# EAGLE design T1200 (EAGLE 9.5.0)
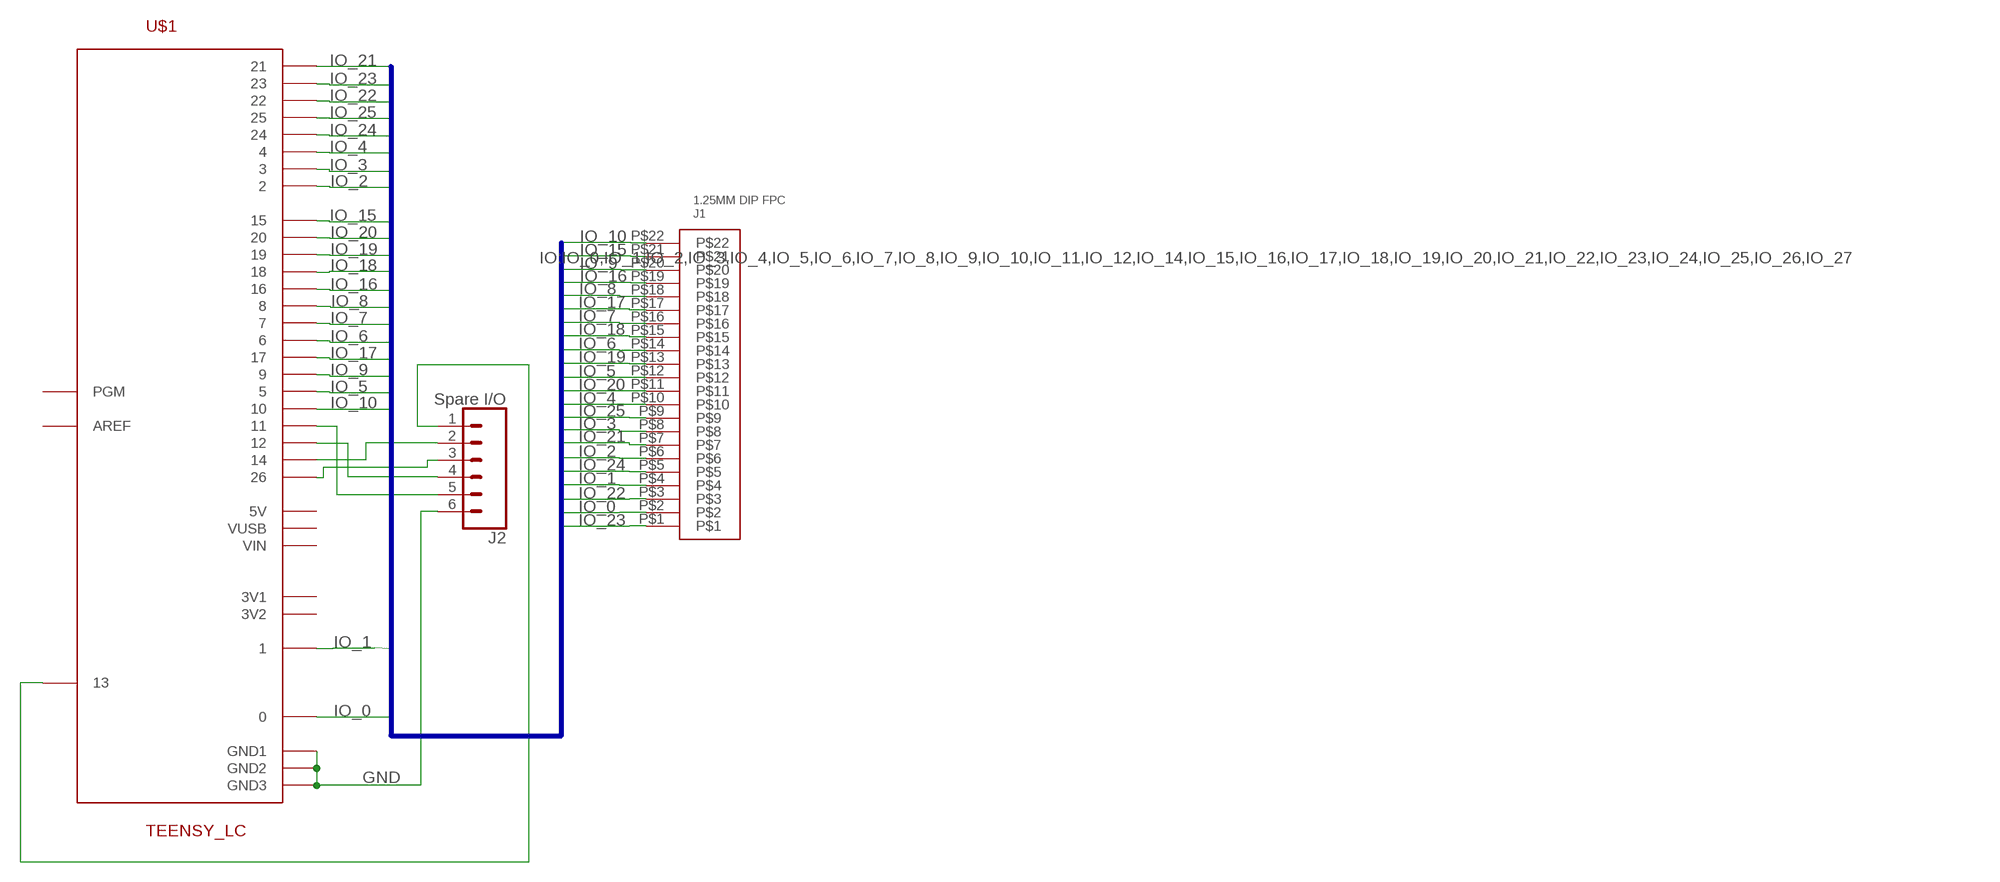
[diagram p0: schematic, sheet 1]

## Parts
J1  1.25MM DIP FPC  T1200_CON  [T1200_CON]
J2  Spare I/O  CONN_06SILK_FEMALE_PTH  [1X06]
U$1  TEENSY_LC  [TEENSY_LC]

## Nets
GND: J2.6 U$1.GND1 U$1.GND2 U$1.GND3
IO_0: J1.P$2 U$1.0
IO_1: J1.P$4 U$1.1
IO_2: J1.P$6 U$1.2
IO_3: J1.P$8 U$1.3
IO_4: J1.P$10 U$1.4
IO_5: J1.P$12 U$1.5
IO_6: J1.P$14 U$1.6
IO_7: J1.P$16 U$1.7
IO_8: J1.P$18 U$1.8
IO_9: J1.P$20 U$1.9
IO_10: J1.P$22 U$1.10
IO_15: J1.P$21 U$1.15
IO_16: J1.P$19 U$1.16
IO_17: J1.P$17 U$1.17
IO_18: J1.P$15 U$1.18
IO_19: J1.P$13 U$1.19
IO_20: J1.P$11 U$1.20
IO_21: J1.P$7 U$1.21
IO_22: J1.P$3 U$1.22
IO_23: J1.P$1 U$1.23
IO_24: J1.P$5 U$1.24
IO_25: J1.P$9 U$1.25
N$1: J2.1 U$1.13
N$2: J2.4 U$1.12
N$4: J2.3 U$1.26
N$5: J2.2 U$1.14
N$7: J2.5 U$1.11
Unconnected: U$1.3V1 U$1.3V2 U$1.5V U$1.AREF U$1.PGM U$1.VIN U$1.VUSB

## Buses
IO:IO_0,IO_1,IO_2,IO_3,IO_4,IO_5,IO_6,IO_7,IO_8,IO_9,IO_10,IO_11,IO_12,IO_14,IO_15,IO_16,IO_17,IO_18,IO_19,IO_20,IO_21,IO_22,IO_23,IO_24,IO_25,IO_26,IO_27

## Library data of the parts
J1 = T1200:T1200_CON
J2 = SparkFun-Connectors:CONN_06: Multi connection point. Often used as Generic Header-pin footprint for 0.1 inch spaced/style header connections On any of the 0.1 inch spaced packages, you can populate with these: Break Away Headers - Straight <https://www.sparkfun.com/products/116> (PRT-00116) Break Away Male Headers - Right Angle <https://www.sparkfun.com/products/553> (PRT-00553) Female Headers <https://www.sparkfun.com/products/115> (PRT-00115) Break Away Headers - Machine Pin <https://www.sparkfun.com/products/117> (PRT-00117) Break Away Female Headers - Swiss Machine Pin <https://www.sparkfun.com/products/743> (PRT-00743) Arduino Stackable Header - 6 Pin <https://www.sparkfun.com/products/9280> (PRT-09280) For SCREWTERMINALS and SPRING TERMINALS visit here: Screw Terimnals on SparkFun.com <https://www.sparkfun.com/search/results?term=Screw+Terminals> (5mm/3.5mm/2.54mm spacing) This device is also useful as a general connection point to wire up your design to another part of your project. Our various solder wires solder well into these plated through hole pads. Hook-Up Wire - Assortment (Stranded, 22 AWG) <https://www.sparkfun.com/products/11375> (PRT-11375) Hook-Up Wire - Assortment (Solid Core, 22 AWG) <https://www.sparkfun.com/products/11367> (PRT-11367) View the entire wire category on our website here <https://www.sparkfun.com/categories/141>; PROD_ID: CONN-08437
U$1 = Teensy_LC:TEENSY_LC

## Board
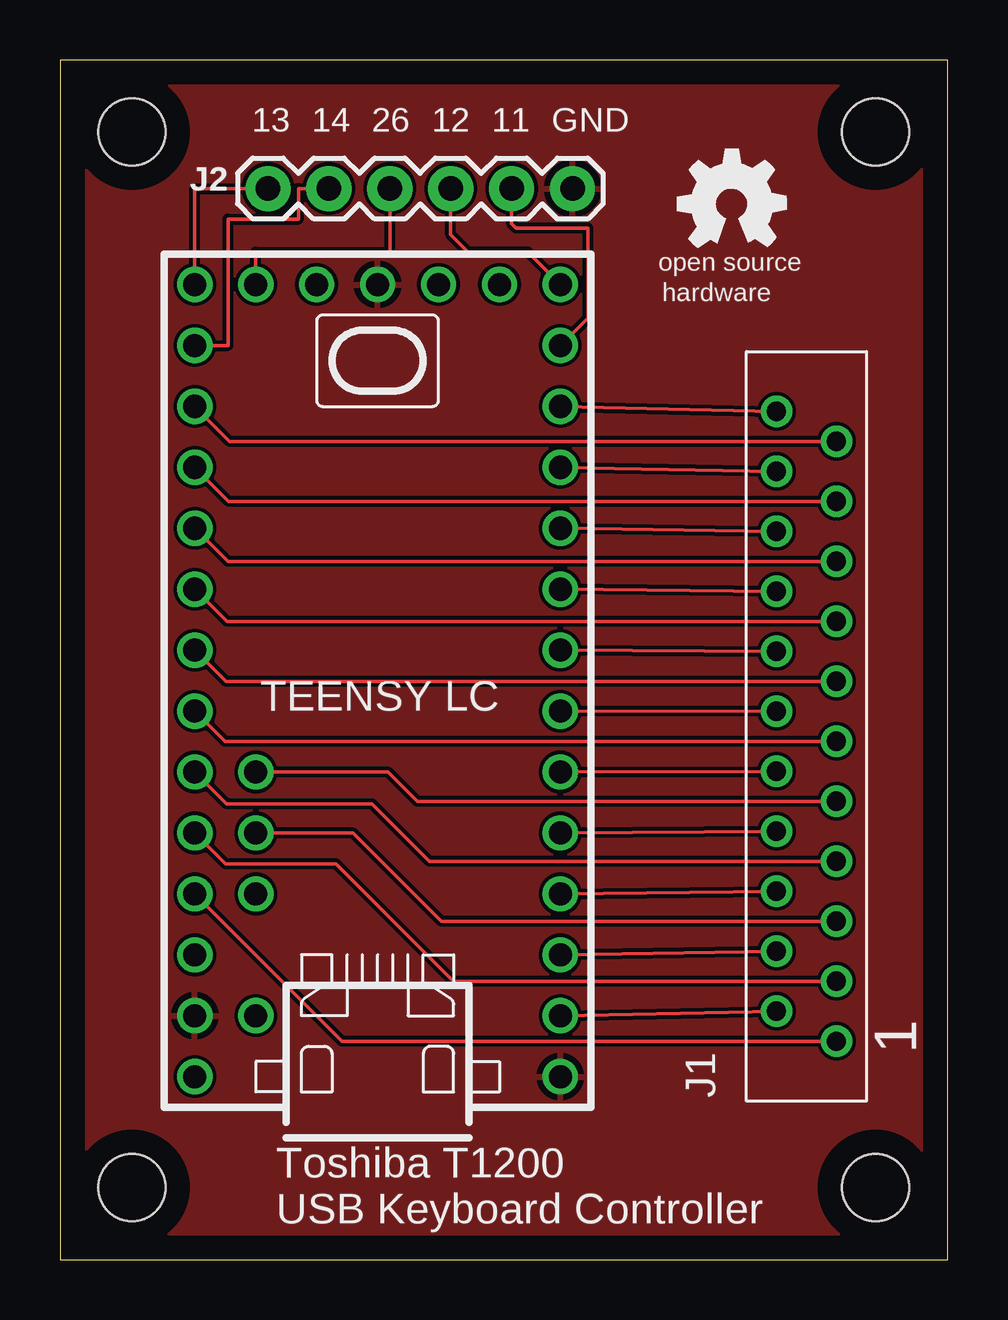
[diagram p1: board, top side]
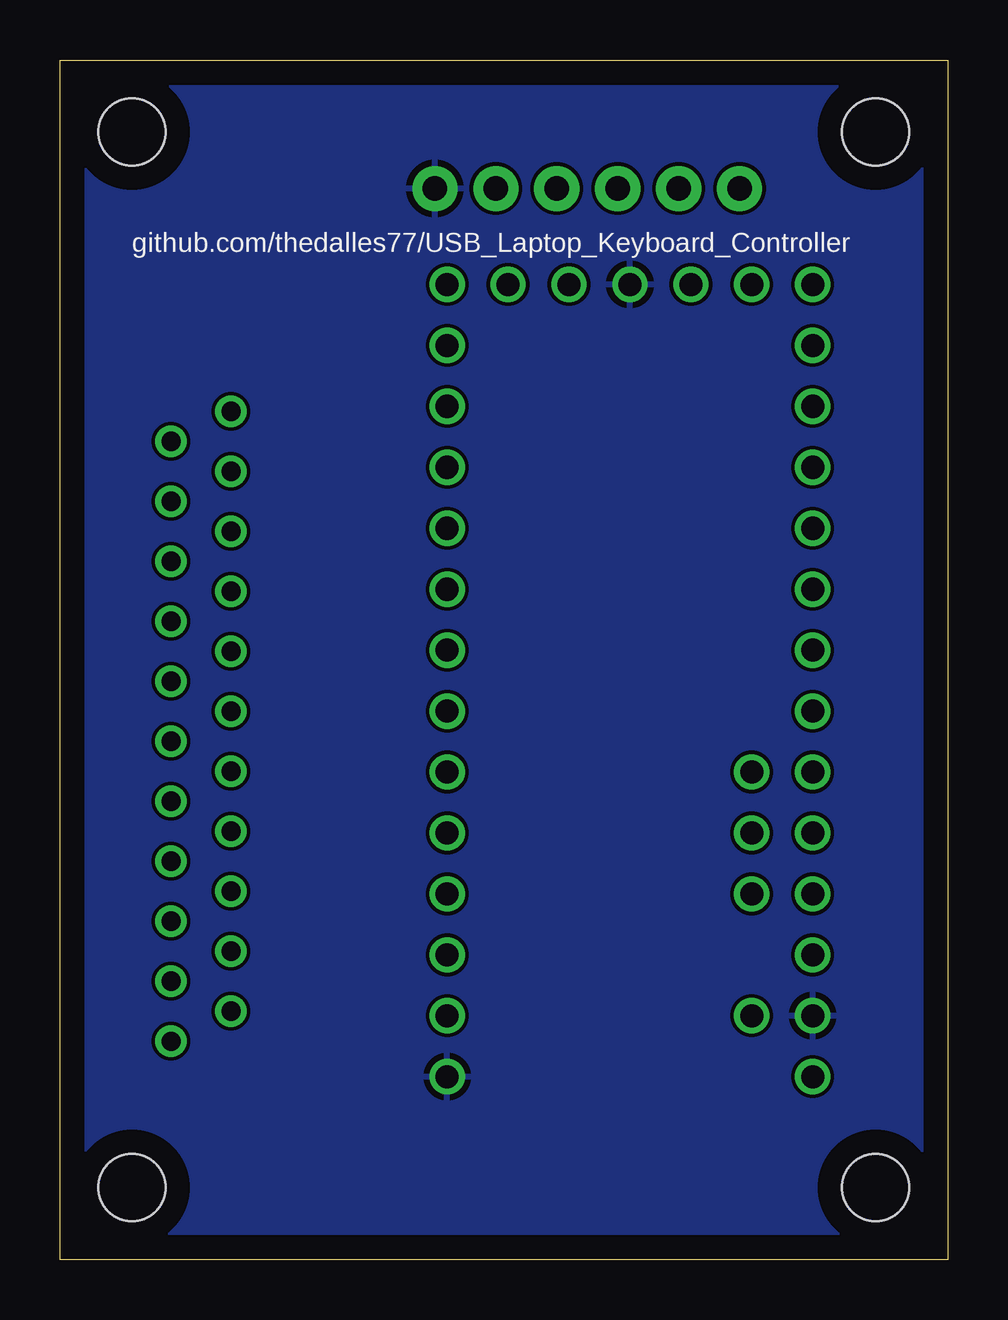
[diagram p2: board, bottom side, seen from below]

Size 37 x 50 mm. Coordinates in mm from the lower left corner, seen from the top.
Outline: 0,0 37,0 37,50 0,50 0,0
Copper layers (1*16): Top 0.035mm / dielectric 1.5mm / Bottom 0.035mm
Design rules "default": minimum track width 6mil, minimum drill 0.35mm, track to track 6mil, track to pad 6mil, pad to pad 6mil, via to via 6mil, smd to smd 6mil, copper to edge 40mil, drill to drill 6mil, minimum pad ring 10mil, minimum via ring 8mil, stop-mask expansion 4mil, vias tented up to drill 0mil, thermal gap 10mil
Holes 2.8 mm at 3,3 3,47 34,3 34,47

### Footprints (pad centres in the part's own frame; a part is rotated, then mirrored left to right if it is on the bottom)
T1200_CON = drill 0.8: P$1 0,0; P$2 1.25,2.5; P$3 2.5,0; P$4 3.75,2.5; P$5 5,0; P$6 6.25,2.5; P$7 7.5,0; P$8 8.75,2.5; P$9 10,0; P$10 11.25,2.5; P$11 12.5,0; P$12 13.75,2.5; P$13 15,0; P$14 16.25,2.5; P$15 17.5,0; P$16 18.75,2.5; P$17 20,0; P$18 21.25,2.5; P$19 22.5,0; P$20 23.75,2.5; P$21 25,0; P$22 26.25,2.5
1X06 = drill 1.016 pad 1.88: 1 0,0; 2 2.54,0; 3 5.08,0; 4 7.62,0; 5 10.16,0; 6 12.7,0
TEENSY_LC = drill 0.965: 0 -13.97,-7.62; 1 -11.43,-7.62; 2 -8.89,-7.62; 3 -6.35,-7.62; 3V1 -11.43,7.62; 3V2 16.51,-2.54; 4 -3.81,-7.62; 5 -1.27,-7.62; 5V -16.51,7.62; 6 1.27,-7.62; 7 3.81,-7.62; 8 6.35,-7.62; 9 8.89,-7.62; 10 11.43,-7.62; 11 13.97,-7.62; 12 16.51,-7.62; 13 16.51,7.62; 14 13.97,7.62; 15 11.43,7.62; 16 8.89,7.62; 17 6.35,7.62; 18 3.81,7.62; 19 1.27,7.62; 20 -1.27,7.62; 21 -3.81,7.62; 22 -6.35,7.62; 23 -8.89,7.62; 24 -6.35,5.08; 25 -3.81,5.08; 26 16.51,5.08; AREF -8.89,5.08; GND1 -16.51,-7.62; GND2 -13.97,7.62; GND3 16.51,0; PGM 16.51,2.54; VIN 16.51,-5.08; VUSB -13.97,5.08

### Placement (x,y rotation side)
J1  32.37,9.1 90 top
J2  8.67,44.64 0 top
U$1  13.24,24.13 90 top
U$2  [OSHW_5MM]  28,44 0 top

### Tracks (layer width: path | path; a pad name or v marks a point on that pad's centre or on a via)
GND
  pour Top: 0,0 0,50 37,50 37,0
  pour Bottom: 0,0 0,50 37,50 37,0
IO_0
  Top 0.152: U$1.0 J1.P$2
IO_1
  Top 0.152: J1.P$4 U$1.1
IO_2
  Top 0.152: U$1.2 J1.P$6
IO_3
  Top 0.152: J1.P$8 U$1.3
IO_4
  Top 0.152: U$1.4 J1.P$10
IO_5
  Top 0.152: J1.P$12 U$1.5
IO_6
  Top 0.152: U$1.6 J1.P$14
IO_7
  Top 0.152: J1.P$16 U$1.7
IO_8
  Top 0.152: U$1.8 J1.P$18
IO_9
  Top 0.152: J1.P$20 U$1.9
IO_10
  Top 0.152: U$1.10 J1.P$22
IO_15
  Top 0.152: J1.P$21 7.08,34.1 U$1.15
IO_16
  Top 0.152: J1.P$19 7.04,31.6 U$1.16
IO_17
  Top 0.152: J1.P$17 7,29.1 U$1.17
IO_18
  Top 0.152: J1.P$15 6.96,26.6 U$1.18
IO_19
  Top 0.152: J1.P$13 6.92,24.1 U$1.19
IO_20
  Top 0.152: J1.P$11 6.88,21.6 U$1.20
IO_21
  Top 0.152: J1.P$7 15.4,16.6 13,19 6.94,19 U$1.21
IO_22
  Top 0.152: J1.P$3 16.4,11.6 11.5,16.5 6.9,16.5 U$1.22
IO_23
  Top 0.152: J1.P$1 11.76,9.1 U$1.23
IO_24
  Top 0.152: U$1.24 12.22,17.78 15.9,14.1 J1.P$5
IO_25
  Top 0.152: J1.P$9 14.9,19.1 13.68,20.32 U$1.25
N$1
  Top 0.152: U$1.13 5.62,44.64 J2.1
N$2
  Top 0.152: U$1.12 19.5,42 17,42 16.29,42.71 J2.4
N$4
  Top 0.152: U$1.26 8.16,42 13.75,42 J2.3
N$5
  Top 0.152: U$1.14 7,38.1 7,43.37 9.94,43.37 9.94,44.64 J2.2
N$7
  Top 0.152: U$1.11 22,39.24 22,43 19,43 18.83,43.17 J2.5

### Text on the board
tPlace: 13 | 14 | 26 | 12 | 11 | GND | 1 | Toshiba T1200 / USB Keyboard Controller
bPlace: github.com/thedalles77/USB_Laptop_Keyboard_Controller